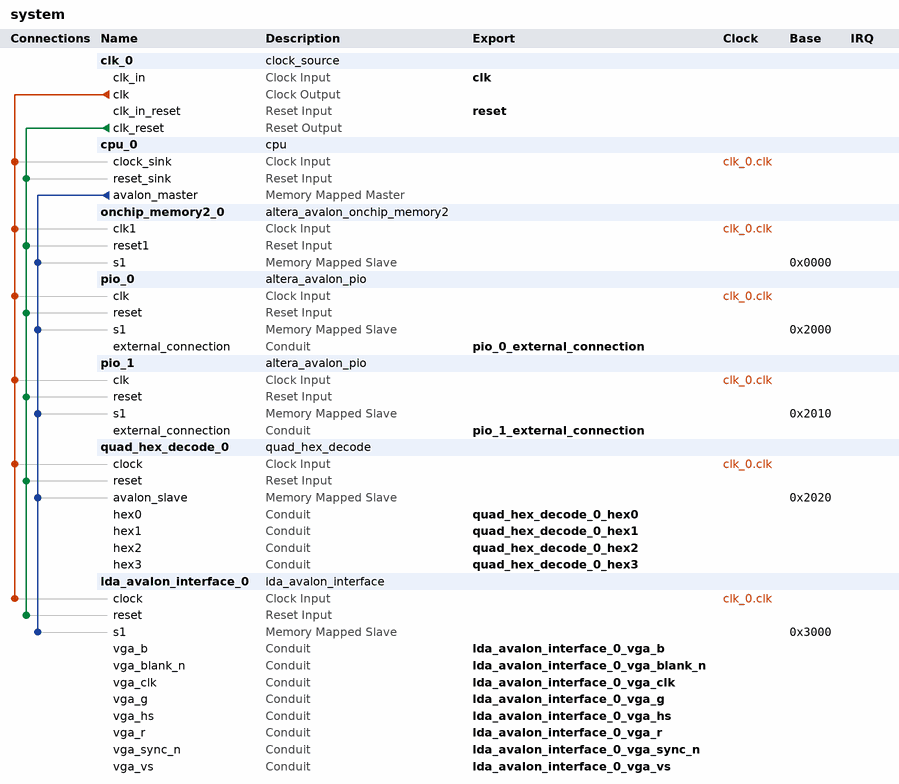
[diagram p0: system contents]
# Platform Designer (Qsys) system system, Cyclone V 5CSEMA5F31C6
# Parameters at their usual value, and those the tool derives, are not listed.
package require -exact qsys 17.0
create_system system
set_project_property DEVICE_FAMILY {Cyclone V}
set_project_property DEVICE 5CSEMA5F31C6

add_instance clk_0 clock_source 17.0
set_instance_parameter_value clk_0 clockFrequency 50000000

add_instance cpu_0 cpu 1.0

add_instance onchip_memory2_0 altera_avalon_onchip_memory2 17.0
set_instance_parameter_value onchip_memory2_0 dataWidth 16
set_instance_parameter_value onchip_memory2_0 dualPort false
set_instance_parameter_value onchip_memory2_0 initMemContent true
set_instance_parameter_value onchip_memory2_0 initializationFileName onchip_mem.mif
set_instance_parameter_value onchip_memory2_0 memorySize 4096
set_instance_parameter_value onchip_memory2_0 useNonDefaultInitFile true

add_instance pio_0 altera_avalon_pio 17.0
set_instance_parameter_value pio_0 direction Input
set_instance_parameter_value pio_0 width 10

add_instance pio_1 altera_avalon_pio 17.0
set_instance_parameter_value pio_1 direction Output
set_instance_parameter_value pio_1 width 10

add_instance quad_hex_decode_0 quad_hex_decode 1.0

add_instance lda_avalon_interface_0 lda_avalon_interface 2.0

# connections
add_connection clk_0.clk cpu_0.clock_sink clock
add_connection clk_0.clk lda_avalon_interface_0.clock clock
add_connection clk_0.clk onchip_memory2_0.clk1 clock
add_connection clk_0.clk pio_0.clk clock
add_connection clk_0.clk pio_1.clk clock
add_connection clk_0.clk quad_hex_decode_0.clock clock
add_connection clk_0.clk_reset cpu_0.reset_sink reset
add_connection clk_0.clk_reset lda_avalon_interface_0.reset reset
add_connection clk_0.clk_reset onchip_memory2_0.reset1 reset
add_connection clk_0.clk_reset pio_0.reset reset
add_connection clk_0.clk_reset pio_1.reset reset
add_connection clk_0.clk_reset quad_hex_decode_0.reset reset
add_connection cpu_0.avalon_master lda_avalon_interface_0.s1 avalon
set_connection_parameter_value cpu_0.avalon_master/lda_avalon_interface_0.s1 baseAddress 0x3000
add_connection cpu_0.avalon_master onchip_memory2_0.s1 avalon
set_connection_parameter_value cpu_0.avalon_master/onchip_memory2_0.s1 baseAddress 0x0000
add_connection cpu_0.avalon_master pio_0.s1 avalon
set_connection_parameter_value cpu_0.avalon_master/pio_0.s1 baseAddress 0x2000
add_connection cpu_0.avalon_master pio_1.s1 avalon
set_connection_parameter_value cpu_0.avalon_master/pio_1.s1 baseAddress 0x2010
add_connection cpu_0.avalon_master quad_hex_decode_0.avalon_slave avalon
set_connection_parameter_value cpu_0.avalon_master/quad_hex_decode_0.avalon_slave baseAddress 0x2020

# exported interfaces
add_interface clk clock sink
set_interface_property clk EXPORT_OF clk_0.clk_in
add_interface lda_avalon_interface_0_vga_b conduit end
set_interface_property lda_avalon_interface_0_vga_b EXPORT_OF lda_avalon_interface_0.vga_b
add_interface lda_avalon_interface_0_vga_blank_n conduit end
set_interface_property lda_avalon_interface_0_vga_blank_n EXPORT_OF lda_avalon_interface_0.vga_blank_n
add_interface lda_avalon_interface_0_vga_clk conduit end
set_interface_property lda_avalon_interface_0_vga_clk EXPORT_OF lda_avalon_interface_0.vga_clk
add_interface lda_avalon_interface_0_vga_g conduit end
set_interface_property lda_avalon_interface_0_vga_g EXPORT_OF lda_avalon_interface_0.vga_g
add_interface lda_avalon_interface_0_vga_hs conduit end
set_interface_property lda_avalon_interface_0_vga_hs EXPORT_OF lda_avalon_interface_0.vga_hs
add_interface lda_avalon_interface_0_vga_r conduit end
set_interface_property lda_avalon_interface_0_vga_r EXPORT_OF lda_avalon_interface_0.vga_r
add_interface lda_avalon_interface_0_vga_sync_n conduit end
set_interface_property lda_avalon_interface_0_vga_sync_n EXPORT_OF lda_avalon_interface_0.vga_sync_n
add_interface lda_avalon_interface_0_vga_vs conduit end
set_interface_property lda_avalon_interface_0_vga_vs EXPORT_OF lda_avalon_interface_0.vga_vs
add_interface pio_0_external_connection conduit end
set_interface_property pio_0_external_connection EXPORT_OF pio_0.external_connection
add_interface pio_1_external_connection conduit end
set_interface_property pio_1_external_connection EXPORT_OF pio_1.external_connection
add_interface quad_hex_decode_0_hex0 conduit end
set_interface_property quad_hex_decode_0_hex0 EXPORT_OF quad_hex_decode_0.hex0
add_interface quad_hex_decode_0_hex1 conduit end
set_interface_property quad_hex_decode_0_hex1 EXPORT_OF quad_hex_decode_0.hex1
add_interface quad_hex_decode_0_hex2 conduit end
set_interface_property quad_hex_decode_0_hex2 EXPORT_OF quad_hex_decode_0.hex2
add_interface quad_hex_decode_0_hex3 conduit end
set_interface_property quad_hex_decode_0_hex3 EXPORT_OF quad_hex_decode_0.hex3
add_interface reset reset sink
set_interface_property reset EXPORT_OF clk_0.clk_in_reset

set_interconnect_requirement {$system} qsys_mm.clockCrossingAdapter HANDSHAKE
set_interconnect_requirement {$system} qsys_mm.enableEccProtection FALSE
set_interconnect_requirement {$system} qsys_mm.insertDefaultSlave FALSE
set_interconnect_requirement {$system} qsys_mm.maxAdditionalLatency 1

save_system system.qsys
